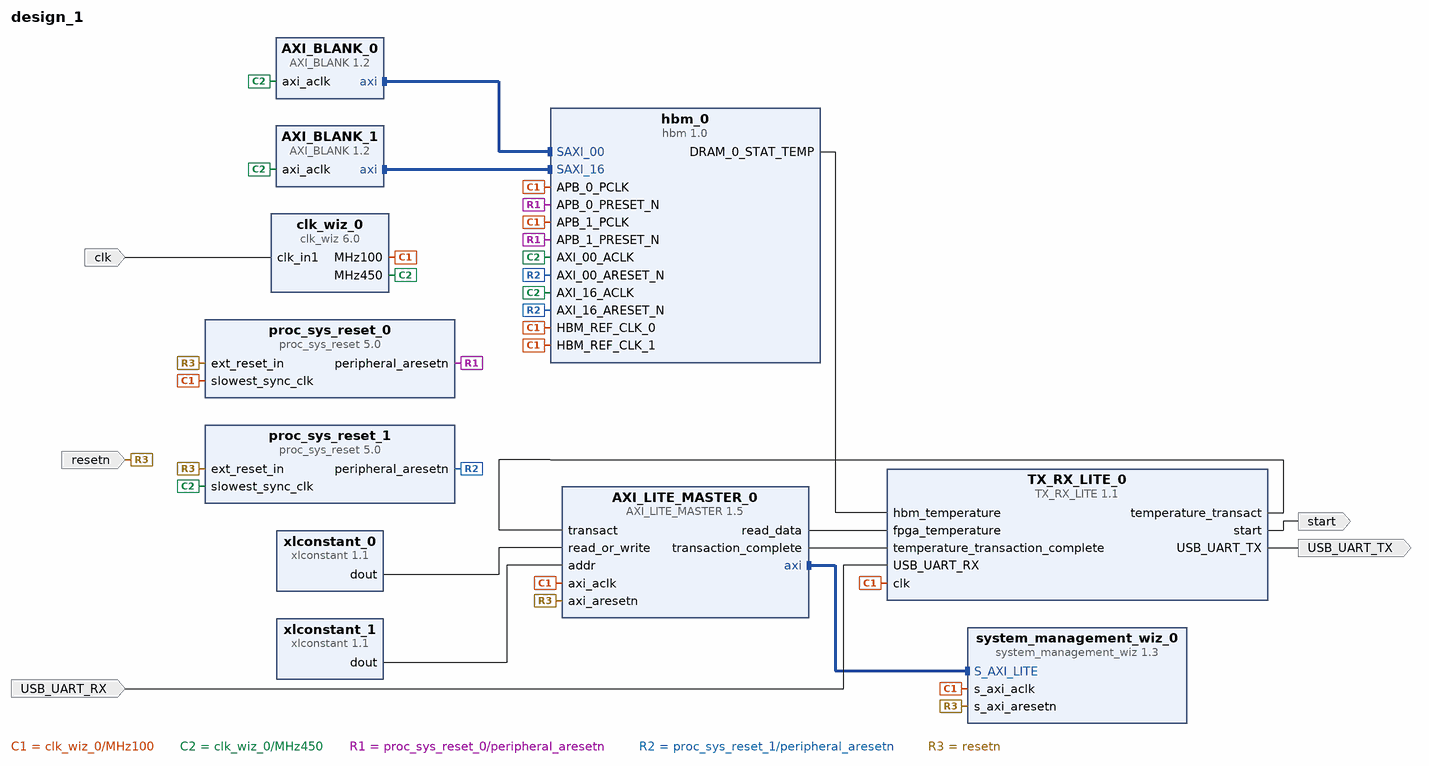
[diagram p0: block diagram of the top level]
# Vivado block design design_1, xcvu33p-fsvh2104-2L-e, Vivado 2020.2
create_bd_design design_1

create_bd_port -dir I -type clk clk
set_property -dict {CONFIG.FREQ_HZ 100000000} [get_bd_ports clk]
create_bd_port -dir I USB_UART_RX
create_bd_port -dir O USB_UART_TX
create_bd_port -dir O start
create_bd_port -dir I resetn

create_bd_cell -type ip -vlnv xilinx.com:ip:hbm:1.0 hbm_0
set_property -dict [list \
  CONFIG.USER_APB_EN false \
  CONFIG.USER_HBM_DENSITY 8GB \
  CONFIG.USER_SAXI_00 true \
  CONFIG.USER_SAXI_01 false \
  CONFIG.USER_SAXI_02 false \
  CONFIG.USER_SAXI_03 false \
  CONFIG.USER_SAXI_04 false \
  CONFIG.USER_SAXI_05 false \
  CONFIG.USER_SAXI_06 false \
  CONFIG.USER_SAXI_07 false \
  CONFIG.USER_SAXI_08 false \
  CONFIG.USER_SAXI_09 false \
  CONFIG.USER_SAXI_10 false \
  CONFIG.USER_SAXI_11 false \
  CONFIG.USER_SAXI_12 false \
  CONFIG.USER_SAXI_13 false \
  CONFIG.USER_SAXI_14 false \
  CONFIG.USER_SAXI_15 false \
  CONFIG.USER_SAXI_16 true \
  CONFIG.USER_SAXI_17 false \
  CONFIG.USER_SAXI_18 false \
  CONFIG.USER_SAXI_19 false \
  CONFIG.USER_SAXI_20 false \
  CONFIG.USER_SAXI_21 false \
  CONFIG.USER_SAXI_22 false \
  CONFIG.USER_SAXI_23 false \
  CONFIG.USER_SAXI_24 false \
  CONFIG.USER_SAXI_25 false \
  CONFIG.USER_SAXI_26 false \
  CONFIG.USER_SAXI_27 false \
  CONFIG.USER_SAXI_28 false \
  CONFIG.USER_SAXI_29 false \
  CONFIG.USER_SAXI_30 false \
  CONFIG.USER_SAXI_31 false \
  CONFIG.USER_XSDB_INTF_EN TRUE \
] [get_bd_cells hbm_0]
create_bd_cell -type ip -vlnv xilinx.com:ip:clk_wiz:6.0 clk_wiz_0
set_property -dict [list \
  CONFIG.CLKOUT1_JITTER 105.942 \
  CONFIG.CLKOUT1_PHASE_ERROR 80.549 \
  CONFIG.CLKOUT2_JITTER 80.879 \
  CONFIG.CLKOUT2_PHASE_ERROR 80.549 \
  CONFIG.CLKOUT2_REQUESTED_OUT_FREQ 450 \
  CONFIG.CLKOUT2_USED true \
  CONFIG.CLK_OUT1_PORT MHz100 \
  CONFIG.CLK_OUT2_PORT MHz450 \
  CONFIG.MMCM_CLKFBOUT_MULT_F 13.500 \
  CONFIG.MMCM_CLKOUT0_DIVIDE_F 13.500 \
  CONFIG.MMCM_CLKOUT1_DIVIDE 3 \
  CONFIG.NUM_OUT_CLKS 2 \
  CONFIG.USE_LOCKED false \
  CONFIG.USE_RESET false \
] [get_bd_cells clk_wiz_0]
create_bd_cell -type ip -vlnv xilinx.com:ip:proc_sys_reset:5.0 proc_sys_reset_0
set_property -dict {CONFIG.RESET_BOARD_INTERFACE Custom CONFIG.USE_BOARD_FLOW true} [get_bd_cells proc_sys_reset_0]
create_bd_cell -type ip -vlnv xilinx.com:ip:proc_sys_reset:5.0 proc_sys_reset_1
set_property -dict {CONFIG.RESET_BOARD_INTERFACE Custom CONFIG.USE_BOARD_FLOW true} [get_bd_cells proc_sys_reset_1]
create_bd_cell -type ip -vlnv user.org:user:AXI_BLANK:1.2 AXI_BLANK_0
create_bd_cell -type ip -vlnv user.org:user:AXI_BLANK:1.2 AXI_BLANK_1
create_bd_cell -type ip -vlnv user.org:user:TX_RX_LITE:1.1 TX_RX_LITE_0
create_bd_cell -type ip -vlnv user.org:user:AXI_LITE_MASTER:1.5 AXI_LITE_MASTER_0
create_bd_cell -type ip -vlnv xilinx.com:ip:xlconstant:1.1 xlconstant_0
set_property -dict {CONFIG.CONST_VAL 0} [get_bd_cells xlconstant_0]
create_bd_cell -type ip -vlnv xilinx.com:ip:xlconstant:1.1 xlconstant_1
set_property -dict {CONFIG.CONST_VAL 0X400 CONFIG.CONST_WIDTH 11} [get_bd_cells xlconstant_1]
create_bd_cell -type ip -vlnv xilinx.com:ip:system_management_wiz:1.3 system_management_wiz_0

# ---- connections ----

connect_bd_intf_net [get_bd_intf_pins AXI_LITE_MASTER_0/axi] [get_bd_intf_pins system_management_wiz_0/S_AXI_LITE]
connect_bd_intf_net [get_bd_intf_pins AXI_BLANK_0/axi] [get_bd_intf_pins hbm_0/SAXI_00]
connect_bd_intf_net [get_bd_intf_pins AXI_BLANK_1/axi] [get_bd_intf_pins hbm_0/SAXI_16]
connect_bd_net [get_bd_pins clk_wiz_0/MHz100] \
  [get_bd_pins hbm_0/HBM_REF_CLK_0] [get_bd_pins hbm_0/HBM_REF_CLK_1] [get_bd_pins hbm_0/APB_0_PCLK] \
  [get_bd_pins hbm_0/APB_1_PCLK] [get_bd_pins proc_sys_reset_0/slowest_sync_clk] [get_bd_pins TX_RX_LITE_0/clk] \
  [get_bd_pins AXI_LITE_MASTER_0/axi_aclk] [get_bd_pins system_management_wiz_0/s_axi_aclk]
connect_bd_net [get_bd_pins clk_wiz_0/MHz450] \
  [get_bd_pins hbm_0/AXI_00_ACLK] [get_bd_pins hbm_0/AXI_16_ACLK] [get_bd_pins proc_sys_reset_1/slowest_sync_clk] \
  [get_bd_pins AXI_BLANK_0/axi_aclk] [get_bd_pins AXI_BLANK_1/axi_aclk]
connect_bd_net [get_bd_pins proc_sys_reset_0/peripheral_aresetn] [get_bd_pins hbm_0/APB_1_PRESET_N] [get_bd_pins hbm_0/APB_0_PRESET_N]
connect_bd_net [get_bd_pins proc_sys_reset_1/peripheral_aresetn] [get_bd_pins hbm_0/AXI_00_ARESET_N] [get_bd_pins hbm_0/AXI_16_ARESET_N]
connect_bd_net [get_bd_pins TX_RX_LITE_0/USB_UART_TX] [get_bd_ports USB_UART_TX]
connect_bd_net [get_bd_pins TX_RX_LITE_0/start] [get_bd_ports start]
connect_bd_net [get_bd_ports USB_UART_RX] [get_bd_pins TX_RX_LITE_0/USB_UART_RX]
connect_bd_net -net clk_100MHz_1 [get_bd_ports clk] [get_bd_pins clk_wiz_0/clk_in1]
connect_bd_net [get_bd_pins hbm_0/DRAM_0_STAT_TEMP] [get_bd_pins TX_RX_LITE_0/hbm_temperature]
connect_bd_net [get_bd_ports resetn] \
  [get_bd_pins proc_sys_reset_1/ext_reset_in] [get_bd_pins proc_sys_reset_0/ext_reset_in] \
  [get_bd_pins AXI_LITE_MASTER_0/axi_aresetn] [get_bd_pins system_management_wiz_0/s_axi_aresetn]
connect_bd_net [get_bd_pins AXI_LITE_MASTER_0/read_data] [get_bd_pins TX_RX_LITE_0/fpga_temperature]
connect_bd_net [get_bd_pins AXI_LITE_MASTER_0/transaction_complete] [get_bd_pins TX_RX_LITE_0/temperature_transaction_complete]
connect_bd_net [get_bd_pins TX_RX_LITE_0/temperature_transact] [get_bd_pins AXI_LITE_MASTER_0/transact]
connect_bd_net [get_bd_pins xlconstant_0/dout] [get_bd_pins AXI_LITE_MASTER_0/read_or_write]
connect_bd_net [get_bd_pins xlconstant_1/dout] [get_bd_pins AXI_LITE_MASTER_0/addr]

# ---- address map ----
assign_bd_address -offset 0x000 -range 4K -target_address_space [get_bd_addr_spaces AXI_BLANK_0/axi] [get_bd_addr_segs hbm_0/SAXI_00/HBM_MEM00]
exclude_bd_addr_seg -offset 0x000 -range 1 -target_address_space [get_bd_addr_spaces AXI_BLANK_0/axi] [get_bd_addr_segs hbm_0/SAXI_00/HBM_MEM01]
exclude_bd_addr_seg -offset 0x000 -range 1 -target_address_space [get_bd_addr_spaces AXI_BLANK_0/axi] [get_bd_addr_segs hbm_0/SAXI_00/HBM_MEM02]
exclude_bd_addr_seg -offset 0x000 -range 1 -target_address_space [get_bd_addr_spaces AXI_BLANK_0/axi] [get_bd_addr_segs hbm_0/SAXI_00/HBM_MEM03]
exclude_bd_addr_seg -offset 0x000 -range 1 -target_address_space [get_bd_addr_spaces AXI_BLANK_0/axi] [get_bd_addr_segs hbm_0/SAXI_00/HBM_MEM04]
exclude_bd_addr_seg -offset 0x000 -range 1 -target_address_space [get_bd_addr_spaces AXI_BLANK_0/axi] [get_bd_addr_segs hbm_0/SAXI_00/HBM_MEM05]
exclude_bd_addr_seg -offset 0x000 -range 1 -target_address_space [get_bd_addr_spaces AXI_BLANK_0/axi] [get_bd_addr_segs hbm_0/SAXI_00/HBM_MEM06]
exclude_bd_addr_seg -offset 0x000 -range 1 -target_address_space [get_bd_addr_spaces AXI_BLANK_0/axi] [get_bd_addr_segs hbm_0/SAXI_00/HBM_MEM07]
exclude_bd_addr_seg -offset 0x000 -range 1 -target_address_space [get_bd_addr_spaces AXI_BLANK_0/axi] [get_bd_addr_segs hbm_0/SAXI_00/HBM_MEM08]
exclude_bd_addr_seg -offset 0x000 -range 1 -target_address_space [get_bd_addr_spaces AXI_BLANK_0/axi] [get_bd_addr_segs hbm_0/SAXI_00/HBM_MEM09]
exclude_bd_addr_seg -offset 0x000 -range 1 -target_address_space [get_bd_addr_spaces AXI_BLANK_0/axi] [get_bd_addr_segs hbm_0/SAXI_00/HBM_MEM10]
exclude_bd_addr_seg -offset 0x000 -range 1 -target_address_space [get_bd_addr_spaces AXI_BLANK_0/axi] [get_bd_addr_segs hbm_0/SAXI_00/HBM_MEM11]
exclude_bd_addr_seg -offset 0x000 -range 1 -target_address_space [get_bd_addr_spaces AXI_BLANK_0/axi] [get_bd_addr_segs hbm_0/SAXI_00/HBM_MEM12]
exclude_bd_addr_seg -offset 0x000 -range 1 -target_address_space [get_bd_addr_spaces AXI_BLANK_0/axi] [get_bd_addr_segs hbm_0/SAXI_00/HBM_MEM13]
exclude_bd_addr_seg -offset 0x000 -range 1 -target_address_space [get_bd_addr_spaces AXI_BLANK_0/axi] [get_bd_addr_segs hbm_0/SAXI_00/HBM_MEM14]
exclude_bd_addr_seg -offset 0x000 -range 1 -target_address_space [get_bd_addr_spaces AXI_BLANK_0/axi] [get_bd_addr_segs hbm_0/SAXI_00/HBM_MEM15]
exclude_bd_addr_seg -offset 0x000 -range 1 -target_address_space [get_bd_addr_spaces AXI_BLANK_0/axi] [get_bd_addr_segs hbm_0/SAXI_00/HBM_MEM16]
exclude_bd_addr_seg -offset 0x000 -range 1 -target_address_space [get_bd_addr_spaces AXI_BLANK_0/axi] [get_bd_addr_segs hbm_0/SAXI_00/HBM_MEM17]
exclude_bd_addr_seg -offset 0x000 -range 1 -target_address_space [get_bd_addr_spaces AXI_BLANK_0/axi] [get_bd_addr_segs hbm_0/SAXI_00/HBM_MEM18]
exclude_bd_addr_seg -offset 0x000 -range 1 -target_address_space [get_bd_addr_spaces AXI_BLANK_0/axi] [get_bd_addr_segs hbm_0/SAXI_00/HBM_MEM19]
exclude_bd_addr_seg -offset 0x000 -range 1 -target_address_space [get_bd_addr_spaces AXI_BLANK_0/axi] [get_bd_addr_segs hbm_0/SAXI_00/HBM_MEM20]
exclude_bd_addr_seg -offset 0x000 -range 1 -target_address_space [get_bd_addr_spaces AXI_BLANK_0/axi] [get_bd_addr_segs hbm_0/SAXI_00/HBM_MEM21]
exclude_bd_addr_seg -offset 0x000 -range 1 -target_address_space [get_bd_addr_spaces AXI_BLANK_0/axi] [get_bd_addr_segs hbm_0/SAXI_00/HBM_MEM22]
exclude_bd_addr_seg -offset 0x000 -range 1 -target_address_space [get_bd_addr_spaces AXI_BLANK_0/axi] [get_bd_addr_segs hbm_0/SAXI_00/HBM_MEM23]
exclude_bd_addr_seg -offset 0x000 -range 1 -target_address_space [get_bd_addr_spaces AXI_BLANK_0/axi] [get_bd_addr_segs hbm_0/SAXI_00/HBM_MEM24]
exclude_bd_addr_seg -offset 0x000 -range 1 -target_address_space [get_bd_addr_spaces AXI_BLANK_0/axi] [get_bd_addr_segs hbm_0/SAXI_00/HBM_MEM25]
exclude_bd_addr_seg -offset 0x000 -range 1 -target_address_space [get_bd_addr_spaces AXI_BLANK_0/axi] [get_bd_addr_segs hbm_0/SAXI_00/HBM_MEM26]
exclude_bd_addr_seg -offset 0x000 -range 1 -target_address_space [get_bd_addr_spaces AXI_BLANK_0/axi] [get_bd_addr_segs hbm_0/SAXI_00/HBM_MEM27]
exclude_bd_addr_seg -offset 0x000 -range 1 -target_address_space [get_bd_addr_spaces AXI_BLANK_0/axi] [get_bd_addr_segs hbm_0/SAXI_00/HBM_MEM28]
exclude_bd_addr_seg -offset 0x000 -range 1 -target_address_space [get_bd_addr_spaces AXI_BLANK_0/axi] [get_bd_addr_segs hbm_0/SAXI_00/HBM_MEM29]
exclude_bd_addr_seg -offset 0x000 -range 1 -target_address_space [get_bd_addr_spaces AXI_BLANK_0/axi] [get_bd_addr_segs hbm_0/SAXI_00/HBM_MEM30]
exclude_bd_addr_seg -offset 0x000 -range 1 -target_address_space [get_bd_addr_spaces AXI_BLANK_0/axi] [get_bd_addr_segs hbm_0/SAXI_00/HBM_MEM31]
assign_bd_address -offset 0x000 -range 4K -target_address_space [get_bd_addr_spaces AXI_BLANK_1/axi] [get_bd_addr_segs hbm_0/SAXI_16/HBM_MEM00]
exclude_bd_addr_seg -offset 0x000 -range 1 -target_address_space [get_bd_addr_spaces AXI_BLANK_1/axi] [get_bd_addr_segs hbm_0/SAXI_16/HBM_MEM01]
exclude_bd_addr_seg -offset 0x000 -range 1 -target_address_space [get_bd_addr_spaces AXI_BLANK_1/axi] [get_bd_addr_segs hbm_0/SAXI_16/HBM_MEM02]
exclude_bd_addr_seg -offset 0x000 -range 1 -target_address_space [get_bd_addr_spaces AXI_BLANK_1/axi] [get_bd_addr_segs hbm_0/SAXI_16/HBM_MEM03]
exclude_bd_addr_seg -offset 0x000 -range 1 -target_address_space [get_bd_addr_spaces AXI_BLANK_1/axi] [get_bd_addr_segs hbm_0/SAXI_16/HBM_MEM04]
exclude_bd_addr_seg -offset 0x000 -range 1 -target_address_space [get_bd_addr_spaces AXI_BLANK_1/axi] [get_bd_addr_segs hbm_0/SAXI_16/HBM_MEM05]
exclude_bd_addr_seg -offset 0x000 -range 1 -target_address_space [get_bd_addr_spaces AXI_BLANK_1/axi] [get_bd_addr_segs hbm_0/SAXI_16/HBM_MEM06]
exclude_bd_addr_seg -offset 0x000 -range 1 -target_address_space [get_bd_addr_spaces AXI_BLANK_1/axi] [get_bd_addr_segs hbm_0/SAXI_16/HBM_MEM07]
exclude_bd_addr_seg -offset 0x000 -range 1 -target_address_space [get_bd_addr_spaces AXI_BLANK_1/axi] [get_bd_addr_segs hbm_0/SAXI_16/HBM_MEM08]
exclude_bd_addr_seg -offset 0x000 -range 1 -target_address_space [get_bd_addr_spaces AXI_BLANK_1/axi] [get_bd_addr_segs hbm_0/SAXI_16/HBM_MEM09]
exclude_bd_addr_seg -offset 0x000 -range 1 -target_address_space [get_bd_addr_spaces AXI_BLANK_1/axi] [get_bd_addr_segs hbm_0/SAXI_16/HBM_MEM10]
exclude_bd_addr_seg -offset 0x000 -range 1 -target_address_space [get_bd_addr_spaces AXI_BLANK_1/axi] [get_bd_addr_segs hbm_0/SAXI_16/HBM_MEM11]
exclude_bd_addr_seg -offset 0x000 -range 1 -target_address_space [get_bd_addr_spaces AXI_BLANK_1/axi] [get_bd_addr_segs hbm_0/SAXI_16/HBM_MEM12]
exclude_bd_addr_seg -offset 0x000 -range 1 -target_address_space [get_bd_addr_spaces AXI_BLANK_1/axi] [get_bd_addr_segs hbm_0/SAXI_16/HBM_MEM13]
exclude_bd_addr_seg -offset 0x000 -range 1 -target_address_space [get_bd_addr_spaces AXI_BLANK_1/axi] [get_bd_addr_segs hbm_0/SAXI_16/HBM_MEM14]
exclude_bd_addr_seg -offset 0x000 -range 1 -target_address_space [get_bd_addr_spaces AXI_BLANK_1/axi] [get_bd_addr_segs hbm_0/SAXI_16/HBM_MEM15]
exclude_bd_addr_seg -offset 0x000 -range 1 -target_address_space [get_bd_addr_spaces AXI_BLANK_1/axi] [get_bd_addr_segs hbm_0/SAXI_16/HBM_MEM16]
exclude_bd_addr_seg -offset 0x000 -range 1 -target_address_space [get_bd_addr_spaces AXI_BLANK_1/axi] [get_bd_addr_segs hbm_0/SAXI_16/HBM_MEM17]
exclude_bd_addr_seg -offset 0x000 -range 1 -target_address_space [get_bd_addr_spaces AXI_BLANK_1/axi] [get_bd_addr_segs hbm_0/SAXI_16/HBM_MEM18]
exclude_bd_addr_seg -offset 0x000 -range 1 -target_address_space [get_bd_addr_spaces AXI_BLANK_1/axi] [get_bd_addr_segs hbm_0/SAXI_16/HBM_MEM19]
exclude_bd_addr_seg -offset 0x000 -range 1 -target_address_space [get_bd_addr_spaces AXI_BLANK_1/axi] [get_bd_addr_segs hbm_0/SAXI_16/HBM_MEM20]
exclude_bd_addr_seg -offset 0x000 -range 1 -target_address_space [get_bd_addr_spaces AXI_BLANK_1/axi] [get_bd_addr_segs hbm_0/SAXI_16/HBM_MEM21]
exclude_bd_addr_seg -offset 0x000 -range 1 -target_address_space [get_bd_addr_spaces AXI_BLANK_1/axi] [get_bd_addr_segs hbm_0/SAXI_16/HBM_MEM22]
exclude_bd_addr_seg -offset 0x000 -range 1 -target_address_space [get_bd_addr_spaces AXI_BLANK_1/axi] [get_bd_addr_segs hbm_0/SAXI_16/HBM_MEM23]
exclude_bd_addr_seg -offset 0x000 -range 1 -target_address_space [get_bd_addr_spaces AXI_BLANK_1/axi] [get_bd_addr_segs hbm_0/SAXI_16/HBM_MEM24]
exclude_bd_addr_seg -offset 0x000 -range 1 -target_address_space [get_bd_addr_spaces AXI_BLANK_1/axi] [get_bd_addr_segs hbm_0/SAXI_16/HBM_MEM25]
exclude_bd_addr_seg -offset 0x000 -range 1 -target_address_space [get_bd_addr_spaces AXI_BLANK_1/axi] [get_bd_addr_segs hbm_0/SAXI_16/HBM_MEM26]
exclude_bd_addr_seg -offset 0x000 -range 1 -target_address_space [get_bd_addr_spaces AXI_BLANK_1/axi] [get_bd_addr_segs hbm_0/SAXI_16/HBM_MEM27]
exclude_bd_addr_seg -offset 0x000 -range 1 -target_address_space [get_bd_addr_spaces AXI_BLANK_1/axi] [get_bd_addr_segs hbm_0/SAXI_16/HBM_MEM28]
exclude_bd_addr_seg -offset 0x000 -range 1 -target_address_space [get_bd_addr_spaces AXI_BLANK_1/axi] [get_bd_addr_segs hbm_0/SAXI_16/HBM_MEM29]
exclude_bd_addr_seg -offset 0x000 -range 1 -target_address_space [get_bd_addr_spaces AXI_BLANK_1/axi] [get_bd_addr_segs hbm_0/SAXI_16/HBM_MEM30]
exclude_bd_addr_seg -offset 0x000 -range 1 -target_address_space [get_bd_addr_spaces AXI_BLANK_1/axi] [get_bd_addr_segs hbm_0/SAXI_16/HBM_MEM31]
assign_bd_address -offset 0x044A00000 -range 64K -target_address_space [get_bd_addr_spaces AXI_LITE_MASTER_0/axi] [get_bd_addr_segs system_management_wiz_0/S_AXI_LITE/Reg]

validate_bd_design
save_bd_design
